# EAGLE schematic glowbs_4 (EAGLE 7.1.0)
DESIGNER: Quin from Qtechknow; VERSION: v10
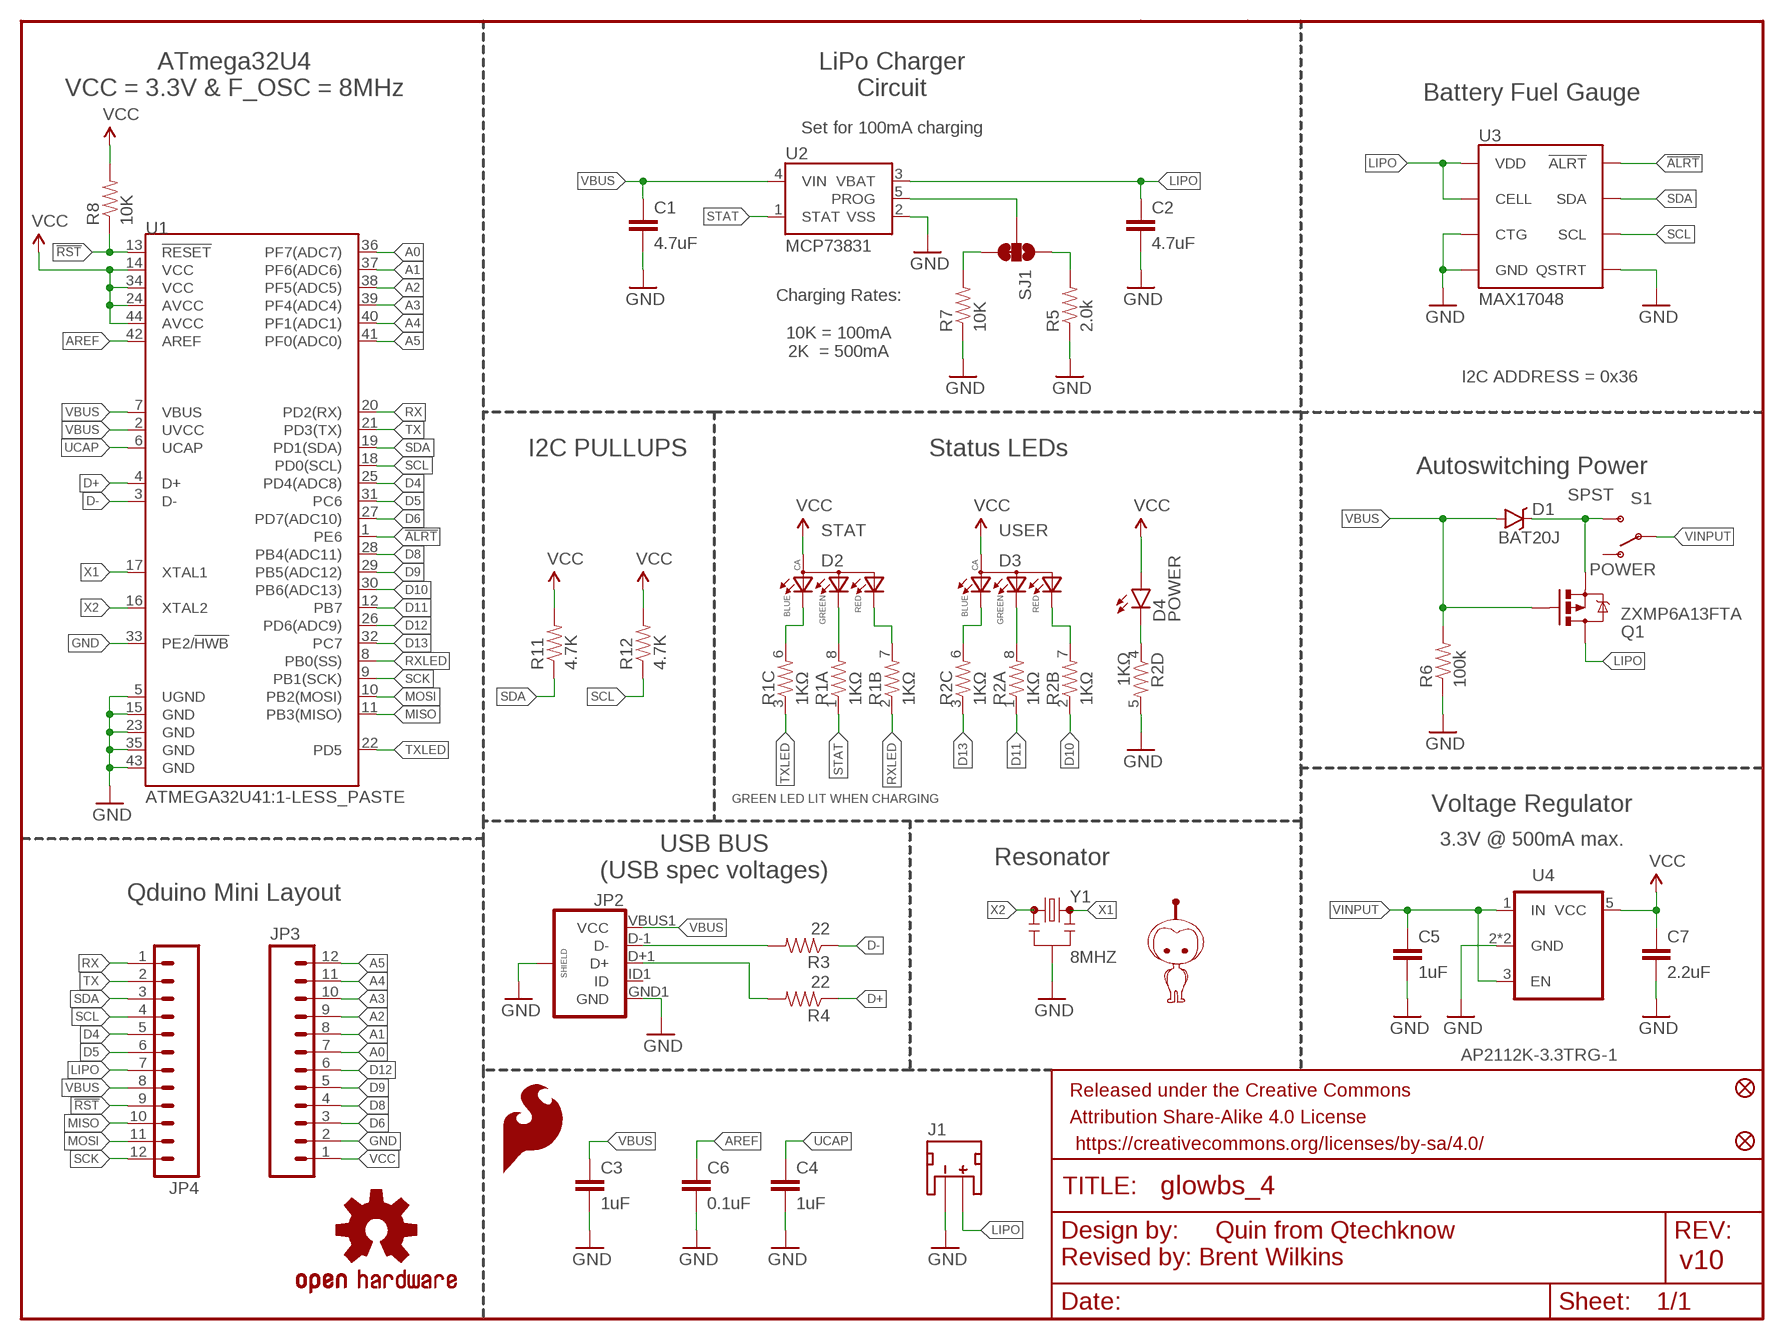
[diagram p0: schematic, sheet 1]

## Parts
C1  4.7uF  CAP0603-CAP  [0603-CAP]
C2  4.7uF  CAP0603-CAP  [0603-CAP]
C3  1uF  CAP0603-CAP  [0603-CAP]
C4  1uF  CAP0603-CAP  [0603-CAP]
C5  1uF  CAP0603-CAP  [0603-CAP]
C6  0.1uF  0.1UF-25V(+80/-20%)(0603)  [0603-CAP]
C7  2.2uF  2.2UF-10V-20%(0603)  [0603-CAP]
D1  BAT20J  DIODE-SCHOTTKY-BAT20J  [SOD-323]
D2  0.13_RGB_LEDPLCC  [P-LCC-4-3]
D3  0.13_RGB_LEDPLCC  [P-LCC-4-3]
D4  POWER  LED-GREEN0603  [LED-0603]
FID1  FIDUCIALUFIDUCIAL  [MICRO-FIDUCIAL]
FID2  FIDUCIALUFIDUCIAL  [MICRO-FIDUCIAL]
FRAME2  FRAME-LETTER  [CREATIVE_COMMONS]
J1  LiPo  JST_2MM_MALE  [JST-2-SMD]
JP2  USB_MICROB_PLUGCONN-11752  [USB-B-MICRO-SMD_V03]
JP3  M12PTH  [1X12]
JP4  M12PTH  [1X12]
LOGO1  OSHW-LOGOS  [OSHW-LOGO-S]
LOGO2  SFE_LOGO_FLAME.1_INCH  [SFE_LOGO_FLAME_.1]
Q1  ZXMP6A13FTA  MOSFET-PCHANNEL  [SOT23-3]
R1  1KΩ  RESISTOR-ARRAY0603-ARV  [0603-ARV]
R2  1KΩ  RESISTOR-ARRAY0603-ARV  [0603-ARV]
R3  22  RESISTOR0603  [0603-RES]
R4  22  RESISTOR0603  [0603-RES]
R5  2.0k  2.0KOHM1/10W5%(0603)  [0603-RES]
R6  100k  100KOHM-1/10W-1%(0603)  [0603-RES]
R7  10K  10KOHM-1/10W-1%(0603)0603  [0603-RES]
R8  10K  10KOHM-1/10W-1%(0603)0603  [0603-RES]
R11  4.7K  RESISTOR0603-RES  [0603-RES]
R12  4.7K  RESISTOR0603-RES  [0603-RES]
S1  POWER  SWITCH-SPDT-SMD-A  [SWITCH-SPST-SMD-A]
SJ1  JUMPER-PAD-3-2OF3_NC_BY_TRACE_SMALL  [PAD-JUMPER-3-2OF3_NC_BY_TRACE_YES_SILK_FULL_BOX]
U1  ATMEGA32U41:1-LESS_PASTE  [QFN-44-NOPAD_1:1-LESS_PASTE]
U2  MCP73831  [SOT23-5]
U3  MAX17048  MAX17048DFN8  [DFN-8]
U4  AP2112K-3.3TRG-1  LDO-TPS78233  [SOT23-5]
U5  MIGHTYQ-L-SILK  [LOGO-LARGE-SILK]
Y1  8MHZ  RESONATOR8MHZ  [RESONATOR-SMD]

## Nets
!ALRT: U1.1(PE6) U3.P$5(!ALRT)
!RST: JP4.9 R8.1 U1.13(!RESET)
A0: JP3.7 U1.36(PF7(ADC7))
A1: JP3.8 U1.37(PF6(ADC6))
A2: JP3.9 U1.38(PF5(ADC5))
A3: JP3.10 U1.39(PF4(ADC4))
A4: JP3.11 U1.40(PF1(ADC1))
A5: JP3.12 U1.41(PF0(ADC0))
AREF: C6.1 U1.42(AREF)
D4: JP4.5 U1.25(PD4(ADC8))
D5: JP4.6 U1.31(PC6)
D6: JP3.3 U1.27(PD7(ADC10))
D8: JP3.4 U1.28(PB4(ADC11))
D9: JP3.5 U1.29(PB5(ADC12))
D10: R2.2 U1.30(PB6(ADC13))
D11: R2.1 U1.12(PB7)
D12: JP3.6 U1.26(PD6(ADC9))
D13: R2.3 U1.32(PC7)
D+: R4.1 U1.4(D+)
D-: R3.1 U1.3(D-)
GND: C1.2 C2.2 C3.2 C4.2 C5.2 C6.2 C7.2 J1.1(-) JP2.GND1(GND) JP2.SHIELD1(SHIELD) JP2.SHIELD2(SHIELD) JP2.SHIELD3(SHIELD) JP3.2 R2.5 R5.1 R6.1 R7.1 U1.5(UGND) U1.15(GND) U1.23(GND) U1.33(PE2/!HWB) U1.35(GND) U1.43(GND) U2.2(VSS) U3.P$1(CTG) U3.P$4(GND) U3.P$6(QSTRT) U3.P$9(GND) U4.2(GND) U4.4(GND) Y1.2
INMOSFET: D1.C Q1.2(S) S1.3(S)
LIPO: C2.1 J1.2(+) JP4.7 Q1.3(D) U2.3(VBAT) U3.P$2(CELL) U3.P$3(VDD)
MISO: JP4.10 U1.11(PB3(MISO))
MOSI: JP4.11 U1.10(PB2(MOSI))
N$1: D2.3(BLUE) R1.6
N$2: D2.2(GREEN) R1.8
N$3: D3.3(BLUE) R2.6
N$4: D4.C R2.4
N$6: R7.2 SJ1.3
N$7: R5.2 SJ1.1
N$8: D3.2(GREEN) R2.8
N$34: D2.1(RED) R1.7
N$37: D3.1(RED) R2.7
PROG: SJ1.2 U2.5(PROG)
RX: JP4.1 U1.20(PD2(RX))
RXLED: R1.2 U1.8(PB0(SS))
SCK: JP4.12 U1.9(PB1(SCK))
SCL: JP4.4 R12.1 U1.18(PD0(SCL)) U3.P$7(SCL)
SDA: JP4.3 R11.1 U1.19(PD1(SDA)) U3.P$8(SDA)
STAT: R1.1 U2.1(STAT)
TX: JP4.2 U1.21(PD3(TX))
TXLED: R1.3 U1.22(PD5)
UCAP: C4.1 U1.6(UCAP)
UD+: JP2.D+1(D+) R4.2
UD-: JP2.D-1(D-) R3.2
VBUS: C1.1 C3.1 D1.A JP2.VBUS1(VCC) JP4.8 Q1.1(G) R6.2 U1.2(UVCC) U1.7(VBUS) U2.4(VIN)
VCC: C7.1 D2.4(ANODE) D3.4(ANODE) D4.A JP3.1 R8.2 R11.2 R12.2 U1.14(VCC) U1.24(AVCC) U1.34(VCC) U1.44(AVCC) U4.5(VCC)
VINPUT: C5.1 S1.2(P) U4.1(IN) U4.3(EN)
X1: U1.17(XTAL1) Y1.3
X2: U1.16(XTAL2) Y1.1
Unconnected: J1.NC1(PAD1) J1.NC2(PAD2) JP2.ID1(ID) R1.4 R1.5 S1.1(O)

## Notes on the sheet
- ATmega32U4
  VCC = 3.3V & F_OSC = 8MHz
- LiPo Charger
  Circuit
- Battery Fuel Gauge
- Set for 100mA charging
- Charging Rates:
  
  10K = 100mA
  2K  = 500mA
- I2C ADDRESS = 0x36
- I2C PULLUPS | Status LEDs
- Autoswitching Power
- SPST
- STAT | USER
- GREEN LED LIT WHEN CHARGING | Voltage Regulator
- 3.3V @ 500mA max.
- USB BUS
  (USB spec voltages)
- Resonator
- Qduino Mini Layout
- Revised by: Brent Wilkins

## Library data of the parts
C1 C2 = SparkFun-Passives:CAP: Capacitor Standard 0603 ceramic capacitor, and 0.1" leaded capacitor.; PROD_ID: CAP-08280
C3-C5 = SparkFun-Passives:CAP: Capacitor Standard 0603 ceramic capacitor, and 0.1" leaded capacitor.; PROD_ID: CAP-00868
C6 = SparkFun-Capacitors:0.1UF-25V(+80/-20%)(0603): CAP-00810 Ceramic Standard decoupling cap; PROD_ID: CAP-00810
C7 = SparkFun-Capacitors:2.2UF-10V-20%(0603): CAP-07888; PROD_ID: CAP-07888
D1 = SparkFun-DiscreteSemi:DIODE-SCHOTTKY: Schottky diodes in SFE's production catalog BAT20J 1A 23V 0.62Vf RB751 120mA 40V 0.37Vf PMEG4005EJ 0.5A 40V 0.42Vf MBRA140 1A 40V 0.5Vf B340A 3A 40V SMA; PROD_ID: DIO-11623
D2 D3 = SparkFun-LED:0.13_RGB_LED: Everlight Red/Green/Blue LED 67-23/R6GHBHC-B01/2T || 67-23/R6GHBH-B01 Size 3.2*2.8*1.9mm Mounting Type SMD Full-Color LED PLCC4 Emitting Color Red/Green/Blue (620-625/530-535/470-475 nm) Chip Material AlGaInP/InGaN/InGaN Luminous Intensity 57-112/225-450/36-72 mcd Viewing Angle 120 deg Lens Type-Color Water Clear Forward Voltage 2.0/3.5/3.5 V Forward Current 10 mA Maximum Forward Voltage 2.4/3.9/3.9 V Maximum Forward Current 25/25/25 mA Min-Max Operating Temperature -40C to +85C Factory Pack 2000 pcs-Reel RoHS ✓; PROD_ID: DIO-12986
D4 = SparkFun-LED:LED-GREEN: Various green LEDs Green LEDs used in SFE Production 0603- DIO-00821 LARGE- DIO-00862 LILYPAD- DIO-09910; PROD_ID: DIO-00821; VALUE: GREEN
FID1 FID2 = SparkFun-Aesthetics:FIDUCIAL: Fiducial Alignment Points Various fiducial points for machine vision alignment.
FRAME2 = SparkFun-Aesthetics:FRAME-LETTER: Schematic Frame Standard 8.5x11 US Letter frame; DESIGNER: NAME; VERSION: v01
J1 = SparkFun-Connectors:JST_2MM_MALE: Mates to single-cell LiPo batteries. CONN-11443 Now with smashable polarity marks!; BTM_NEG: -; BTM_POS: +; PROD_ID: CONN-11443; TOP_NEG: -; TOP_POS: +
JP2 = SparkFun-Connectors:USB_MICROB_PLUG: USB Micro-B connectors Some male, some female. Watch your step!; PROD_ID: CONN-11752
JP3 JP4 = SparkFun-Connectors:M12: Header 12 Standard 12-pin 0.1" header. Use with straight break away headers (SKU : PRT-00116), right angle break away headers (PRT-00553), swiss pins (PRT-00743), machine pins (PRT-00117), and female headers (PRT-00115).; PROD_ID: CONN-09693
LOGO1 = SparkFun-Aesthetics:OSHW-LOGO: Open Source Hardware Logo This logo indicates the piece of hardware it is found on incorporates a OSHW license and/or adheres to the definition of open source hardware found here: http://freedomdefined.org/OSHW
LOGO2 = SparkFun-Aesthetics:SFE_LOGO_FLAME: SFE Logo, flame only This is the SparkFun flame logo. The logo on the schematic will always be the same size; the package variant is the height of the flame. Default layer for the logo on the board is tSilk.
Q1 = SparkFun-DiscreteSemi:MOSFET-PCHANNEL: Generic PMOSFET IRLML2244 - TRANS-11153 (SOT-23 -20V -4.3A) (1.Gate 2.Source 3.Drain) FQP27P06 - COM-10349 <http://www.sparkfun.com/products/10349> (TO-220 -60V -27A) (1.Gate 2.Source 3.Drain); PROD_ID: TRANS-08285
R1 R2 = SparkFun-Passives:RESISTOR-ARRAY: Array Chip Resistor Source: RS Component / Phycomp; PROD_ID: RES-12985
R3 R4 = SparkFun-Resistors:RESISTOR: Resistor Basic schematic elements and footprints for 0603, 1206, and PTH resistors.; PROD_ID: RES-08698
R5 = SparkFun-Resistors:2.0KOHM1/10W5%(0603): RES-08296; PROD_ID: RES-08296
R6 = SparkFun-Resistors:100KOHM-1/10W-1%(0603): RES-07828; PROD_ID: RES-07828
R7 R8 = SparkFun-Resistors:10KOHM-1/10W-1%(0603): RES-00824; PROD_ID: RES-00824
R11 R12 = SparkFun-Passives:RESISTOR: Resistor Basic schematic elements and footprints for 0603, 1206, and PTH resistors.; PROD_ID: RES-07857
S1 = SparkFun-Electromechanical:SWITCH-SPDT: SPDT Switch Simple slide switch, Spark Fun Electronics SKU : COM-00102 DPDT SMT slide switch, AYZ0202, SWCH-08179; PROD_ID: SWCH-10651
SJ1 = SparkFun-Passives:JUMPER-PAD-3-2OF3_NC_BY_TRACE
U1 = SparkFun-DigitalIC:ATMEGA32U4: Atmel 44-pin 8-bit Microcontroller with 32KBytes of ISP Flash and USB Controller; PROD_ID: IC-10828
U2 = SparkFun:MCP73831: Microchip's MCP73831 Miniature single cell, fully integrated Li-Ion, Li-polymer charge management controller http://ww1.microchip.com/downloads/en/DeviceDoc/21984a.pdf; PROD_ID: IC-09995
U3 = SparkFun-DigitalIC:MAX17048: Micropower 1-Cell Li+ ModelGauge; PROD_ID: IC-12551
U4 = SparkFun-PowerIC:LDO-TPS78233: Voltage Regulator LDO 500nA Ground Current, 150mA, Ultra-Low Quiescent Current Low-Dropout Linear Regulator.; PROD_ID: VREG-12457
U5 = SparkFun-Aesthetics:MIGHTYQ-L-SILK
Y1 = SparkFun-FreqCtrl:RESONATOR: Resonator Small SMD resonator. Used, eg, on the Arduino Pro/ Pro Mini boards. 8MHz- XTAL-08895 16MHz- XTAL-08900; PROD_ID: XTAL-08895

## Net classes
2 gnd: width 0.254 mm, drill 0.61 mm, clearance 0.254 mm